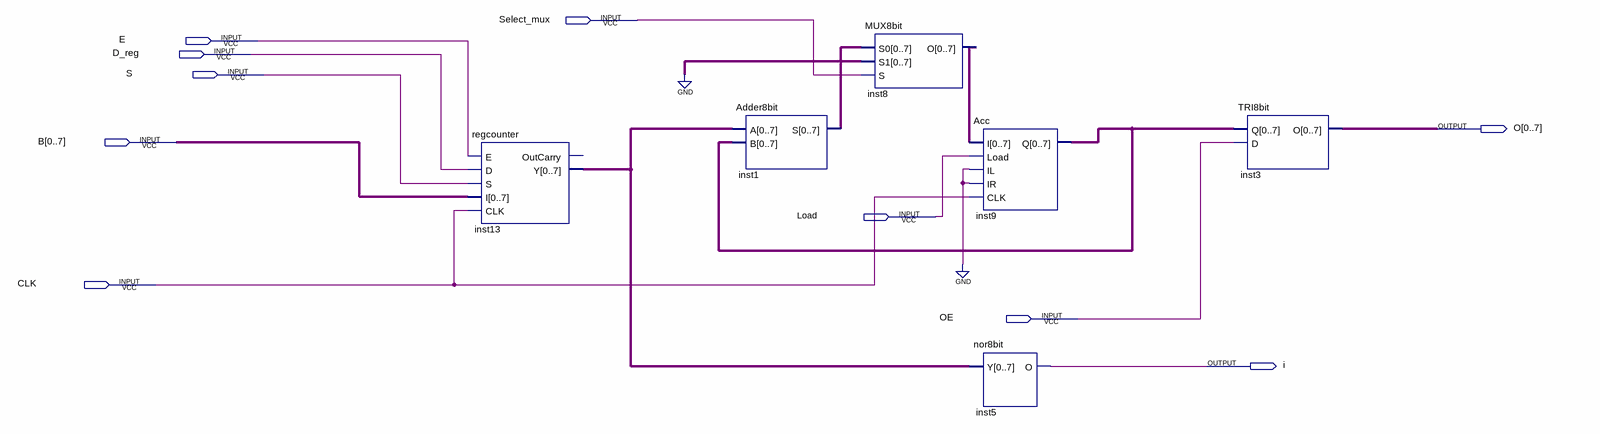
[diagram p0: schematic sheet]
// Quartus schematic LAB4.bdf as structural Verilog: 6 symbols, 10 pins
module LAB4 (
  input  Select_mux,
  input  E,
  input  D_reg,
  input  S,
  input  [0:7] B,
  input  Load,
  input  CLK,
  input  OE,
  output [0:7] O,
  output i
);

  wire [7:0] inst1_s, inst8_o, inst9_q, inst13_y;

  regcounter inst13 (.E(E), .D(D_reg), .S(S), .I(B), .CLK(CLK), .Y(inst13_y));  // open: OutCarry
  Adder8bit inst1 (.A(inst13_y), .B(inst9_q), .S(inst1_s));
  MUX8bit inst8 (.S0(inst1_s), .S1({8{1'b0}}), .S(Select_mux), .O(inst8_o));
  Acc inst9 (.I(inst8_o), .Load(Load), .IL(1'b0), .IR(1'b0), .CLK(CLK), .Q(inst9_q));
  nor8bit inst5 (.Y(inst13_y), .O(i));
  TRI8bit inst3 (.Q(inst9_q), .D(OE), .O(O));
endmodule
